# Altium project karmanDB_pcb.PrjPcb (part 3 of 3)

## Sheet karmanDB_amp.SchDoc
size A
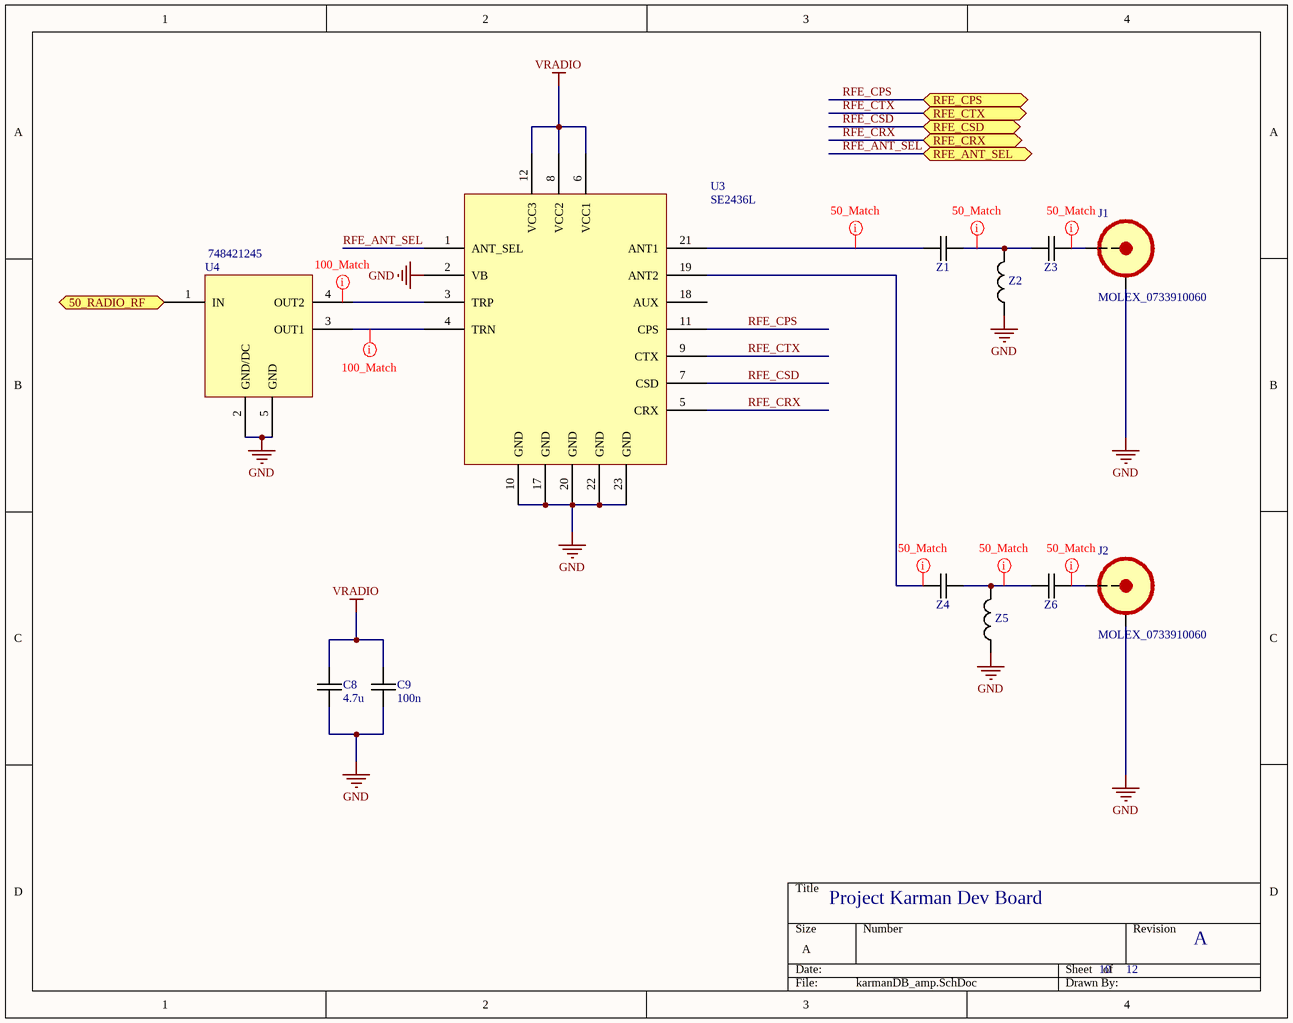
[diagram p9: karmanDB_amp.SchDoc]

### Parts
C8  4.7u  [MURATA_GRM_0603]
C9  100n  [MURATA_GRM_0603]
J1  MOLEX_0733910060  [MOLEX_0733910060]
J2  MOLEX_0733910060  [MOLEX_0733910060]
U3  SE2436L  [9 SE2436L]
U4  748421245  [748421245]
Z1  CAP_GENERIC_0402  [MURATA_GRM_0402]  (value not drawn)
Z2  IND_GENERIC_0402  [PANASONIC_ELJRF]  (value not drawn)
Z3  CAP_GENERIC_0402  [MURATA_GRM_0402]  (value not drawn)
Z4  CAP_GENERIC_0402  [MURATA_GRM_0402]  (value not drawn)
Z5  IND_GENERIC_0402  [PANASONIC_ELJRF]  (value not drawn)
Z6  CAP_GENERIC_0402  [MURATA_GRM_0402]  (value not drawn)

### Ports
50_RADIO_RF (in), RFE_ANT_SEL (bidir), RFE_CPS (bidir), RFE_CRX (bidir), RFE_CSD (bidir), RFE_CTX (bidir)

### Nets
GND: C8.2 C9.2 J1.SHIELD J2.SHIELD U3.2(VB) U3.10(GND) U3.17(GND) U3.20(GND) U3.22(GND) U3.23(GND) U4.2(GND/DC) U4.5(GND) Z2.1 Z5.1
VRADIO: C8.1 C9.1 U3.6(VCC1) U3.8(VCC2) U3.12(VCC3)
RFE_ANT_SEL: U3.1(ANT_SEL) ; port RFE_ANT_SEL
RFE_CPS: U3.11(CPS) ; port RFE_CPS
RFE_CRX: U3.5(CRX) ; port RFE_CRX
RFE_CSD: U3.7(CSD) ; port RFE_CSD
RFE_CTX: U3.9(CTX) ; port RFE_CTX
NetC47_2: U4.1(IN) ; port 50_RADIO_RF
NetJ1_PIN: J1.PIN Z3.2
NetJ2_PIN: J2.PIN Z6.2
NetU3_3: U3.3(TRP) U4.4(OUT2)
NetU3_4: U3.4(TRN) U4.3(OUT1)
NetU3_19: U3.19(ANT2) Z4.1
NetU3_21: U3.21(ANT1) Z1.1
NetZ1_2: Z1.2 Z2.2 Z3.1
NetZ4_2: Z4.2 Z5.2 Z6.1

Not connected (* = marked no-connect by the designer): U3 18(AUX)

### Layout directives
net class 50_Match_Class: NetJ1_PIN, NetJ2_PIN, NetU3_19, NetU3_21, NetZ1_2, NetZ4_2
net class 100_Match_Class: (no net found under the mark), NetU3_4

### Notes on the sheet
- Project Karman Dev Board
- 10
- 12
- A

### Library data of the parts
C8 = CAP_MURATA_GRM188R61C475MAAJD: CAP CER 4.7UF 16V 20% X5R 0603; Manufacturer: Murata Electronics North America; Capacitance: 4.7µF; Supplier 1: Digi-Key; Supplier Part Number 1: 490-10482-1-ND; Manufacturer Part Number: GRM188R61C475MAAJD; RoHS: RoHS Compliant; Category: Capacitors; Stock 1: 3465; Pricing: 1=0.3, 10=0.251, 25=0.1728, 50=0.1414, 100=0.1256, 250=0.0942, 500=0.08322, 1000=0.07379 (USD); Packaging: Cut Tape (CT); Tolerance: ±20%; Voltage - Rated: 16V; Temperature Coefficient: X5R; Mounting Type: Surface Mount, MLCC; Operating Temperature: -55°C ~ 85°C; Applications: General Purpose; Ratings: -; Package / Case: 0603 (1608 Metric); Size / Dimension: 0.063" L x 0.031" W (1.60mm x 0.80mm); Height - Seated (Max): -; Thickness (Max): 0.037" (0.95mm); Lead Spacing: -; Features: -; Lead Style: -; ComponentLink1URL: http://www.murata.com/~/media/webrenewal/support/library/catalog/products/capacitor/mlcc/c02e.ashx; ComponentLink1Description: http://www.murata.com/~/media/webrenewal/support/library/catalog/products/capacitor/mlcc/c02e.ashx
C9 = CAP_MURATA_GRM188R71C104KA01D: CAP CER 0.1UF 16V 10% X7R 0603; Manufacturer: Murata Electronics North America; Capacitance: 0.1µF; Supplier 1: Digi-Key; Supplier Part Number 1: 490-1532-1-ND; Manufacturer Part Number: GRM188R71C104KA01D; RoHS: RoHS Compliant; Category: Capacitors; Stock 1: 2486193; Pricing: 1=0.1, 10=0.019, 50=0.0102, 100=0.0086, 250=0.00704, 500=0.006, 1000=0.00468 (USD); Packaging: Cut Tape (CT); Tolerance: ±10%; Voltage - Rated: 16V; Temperature Coefficient: X7R; Mounting Type: Surface Mount, MLCC; Operating Temperature: -55°C ~ 125°C; Applications: General Purpose; Ratings: -; Package / Case: 0603 (1608 Metric); Size / Dimension: 0.063" L x 0.031" W (1.60mm x 0.80mm); Height - Seated (Max): -; Thickness (Max): 0.035" (0.90mm); Lead Spacing: -; Features: -; Lead Style: -; ComponentLink1URL: http://www.murata.com/~/media/webrenewal/support/library/catalog/products/capacitor/mlcc/c02e.ashx; ComponentLink1Description: http://www.murata.com/~/media/webrenewal/support/library/catalog/products/capacitor/mlcc/c02e.ashx
J1 J2 = MOLEX_0733910060: CONN SMA JACK STR 50 OHM PCB; Manufacturer: Molex Inc; Connector Type: Jack, Female Socket; Contact Termination: Solder; Impedance: 50 Ohm; Frequency - Max: 18GHz; Body Material: Brass; Body Finish: Gold; Center Contact Material: Beryllium Copper; Dielectric Material: Polytetrafluoroethylene (PTFE); Voltage Rating: 500V; Supplier 1: Digi-Key; Manufacturer Part Number: 0733910060; RoHS: RoHS Compliant; Category: Connectors, Interconnects; Stock 1: 6663; Packaging: Bulk; Connector Style: SMA; Shield Termination: Solder; Mounting Type: Through Hole; Cable Group: -; Fastening Type: Threaded; Features: -; Housing Color: Gold; Ingress Protection: -; Center Contact Plating: Gold; Operating Temperature: -65°C ~ 165°C; ComponentLink1URL: http://www.molex.com/pdm_docs/sd/733910060_sd.pdf; ComponentLink1Description: http://www.molex.com/pdm_docs/sd/733910060_sd.pdf; Supplier Part Number 1: WM5543-ND; Pricing: 1=2.99, 10=2.87, 25=2.6308, 50=2.5114, 100=2.3918, 250=2.09284, 500=2.03304, 1000=1.73406, 2500=1.61446 (USD)
U3 = SE2436L: ZIGBEE FRONT END MODULE; Manufacturer: Skyworks Solutions Inc.; Supplier 1: Digi-Key; Manufacturer Part Number: SE2436L; RoHS: RoHS Compliant; Category: RF/IF and RFID; Stock 1: 0; Pricing 1: 3000=1.5 (USD); ComponentLink1URL: http://www.skyworksinc.com/uploads/documents/SE2436L_202413C.pdf; ComponentLink1Description: http://www.skyworksinc.com/uploads/documents/SE2436L_202413C.pdf; Supplier Part Number 1: SE2436L-ND
U4 = 748421245: BALUN EMBER351 & 357 0805 SMD; Manufacturer: Wurth Electronics Inc; Frequency Range: 2.4GHz ~ 2.5GHz; Impedance - Unbalanced/Balanced: 50 / 100 Ohm; Phase Difference: 180° ±10; Insertion Loss (Max): 1.0dB; Supplier 1: Digi-Key; Manufacturer Part Number: 748421245; RoHS: RoHS Compliant; Category: RF/IF and RFID; Stock 1: 20266; Pricing 1: 1=2.63, 50=2.3626, 100=2.1875, 500=2.0125, 1000=1.925, 2000=1.8375 (USD); Packaging: Cut Tape (CT); Return Loss (Min): -; Package / Case: 0805 (2012 Metric); Mounting Type: Surface Mount; ComponentLink1URL: http://katalog.we-online.de/pbs/datasheet/748421245.pdf; ComponentLink1Description: http://katalog.we-online.de/pbs/datasheet/748421245.pdf; Supplier Part Number 1: 732-2230-1-ND
Z1 Z3 Z4 Z6 = CAP_GENERIC_0402: Generic Capacitor 0402 Package; Capacitance: 1000pF; Category: Capacitors; Applications: General Purpose; Size / Dimension: 0.039" L x 0.020" W (1.00mm x 0.50mm); Package / Case: 0402 (1005 Metric); Mounting Type: Surface Mount, MLCC
Z2 Z5 = IND_GENERIC_0402: Generic Inductor 0402 Package; Mounting Type: Surface Mount; Package / Case: 0402 (1005 Metric)

## Sheet karmanDB_pyro.SchDoc
size A
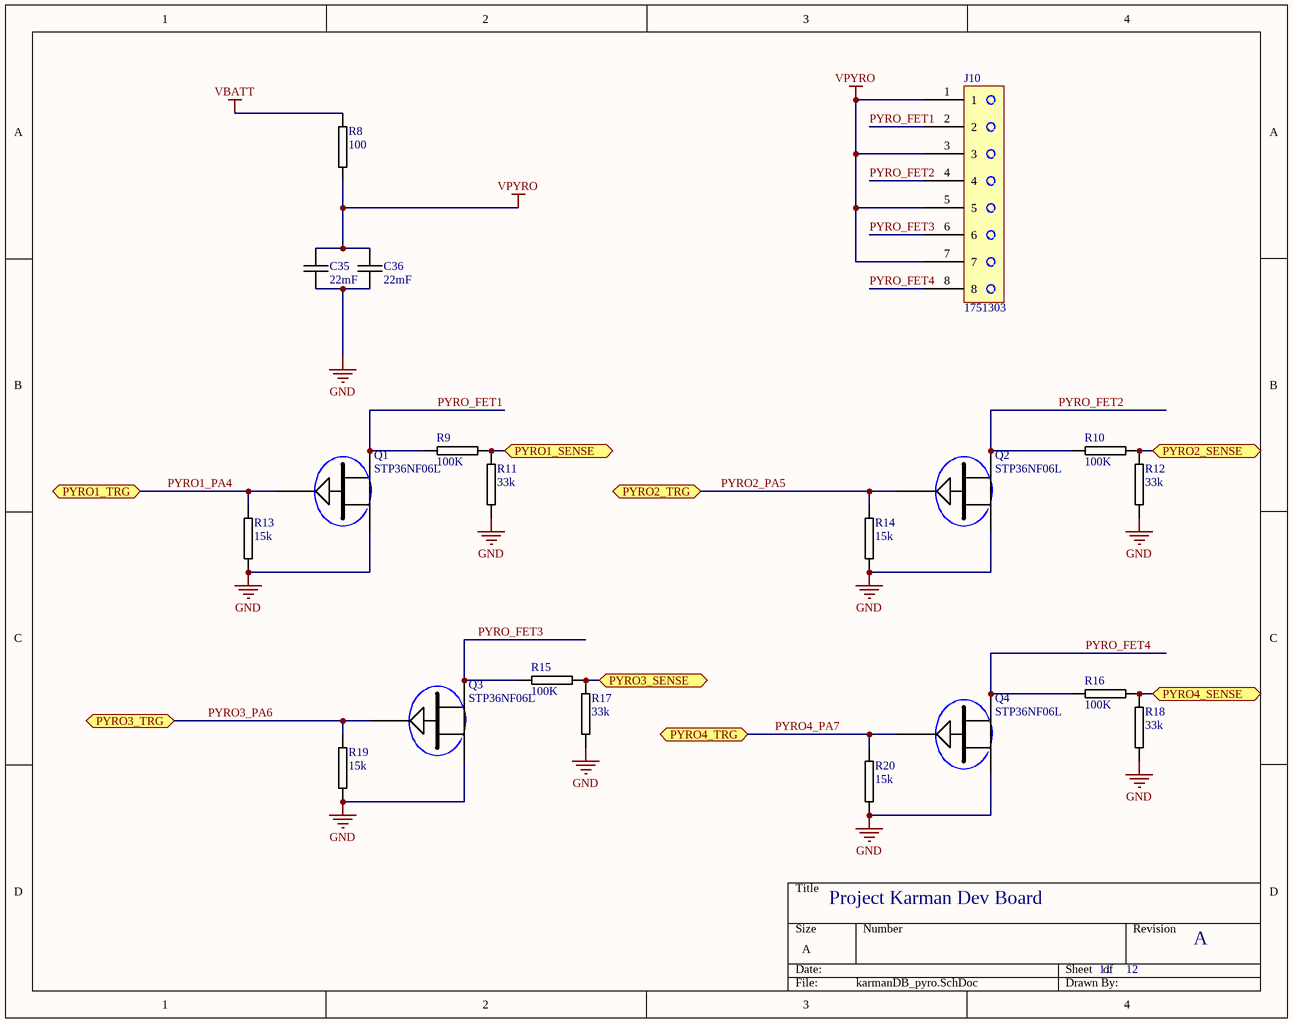
[diagram p10: karmanDB_pyro.SchDoc]

### Parts
C35  22mF  [AVX_BZ01]
C36  22mF  [AVX_BZ01]
J10  1751303  [1751303]
Q1  STP36NF06L  [ST(P/B)36NF06L]
Q2  STP36NF06L  [ST(P/B)36NF06L]
Q3  STP36NF06L  [ST(P/B)36NF06L]
Q4  STP36NF06L  [ST(P/B)36NF06L]
R8  100  [PANASONIC_ERJ1T]
R9  100K  [PANASONIC_ERJ3R]
R10  100K  [PANASONIC_ERJ3R]
R11  33k  [PANASONIC_ERJ2R_SERIES]
R12  33k  [PANASONIC_ERJ2R_SERIES]
R13  15k  [PANASONIC_ERJ3R]
R14  15k  [PANASONIC_ERJ3R]
R15  100K  [PANASONIC_ERJ3R]
R16  100K  [PANASONIC_ERJ3R]
R17  33k  [PANASONIC_ERJ2R_SERIES]
R18  33k  [PANASONIC_ERJ2R_SERIES]
R19  15k  [PANASONIC_ERJ3R]
R20  15k  [PANASONIC_ERJ3R]

### Ports
PYRO1_SENSE (bidir), PYRO1_TRG (bidir), PYRO2_SENSE (bidir), PYRO2_TRG (bidir), PYRO3_SENSE (bidir), PYRO3_TRG (bidir), PYRO4_SENSE (bidir), PYRO4_TRG (bidir)

### Nets
GND: C35.2 C36.2 Q1.3(S) Q2.3(S) Q3.3(S) Q4.3(S) R11.2 R12.2 R13.2 R14.2 R17.2 R18.2 R19.2 R20.2
VBATT: R8.1
VPYRO: C35.1 C36.1 J10.1 J10.3 J10.5 J10.7 R8.2
PYRO1_PA4: Q1.1(G) R13.1 ; port PYRO1_TRG
PYRO1_SENSE: R9.2 R11.1 ; port PYRO1_SENSE
PYRO2_PA5: Q2.1(G) R14.1 ; port PYRO2_TRG
PYRO2_SENSE: R10.2 R12.1 ; port PYRO2_SENSE
PYRO3_PA6: Q3.1(G) R19.1 ; port PYRO3_TRG
PYRO3_SENSE: R15.2 R17.1 ; port PYRO3_SENSE
PYRO4_PA7: Q4.1(G) R20.1 ; port PYRO4_TRG
PYRO4_SENSE: R16.2 R18.1 ; port PYRO4_SENSE
PYRO_FET1: J10.2 Q1.2(D) R9.1
PYRO_FET2: J10.4 Q2.2(D) R10.1
PYRO_FET3: J10.6 Q3.2(D) R15.1
PYRO_FET4: J10.8 Q4.2(D) R16.1

### Notes on the sheet
- Project Karman Dev Board
- 11
- 12
- A

### Library data of the parts
C35 C36 = BZ01CA223ZSB: CAP 22MF -20% +80% 12V SMD; Manufacturer: AVX Corporation; Tolerance: -20%, +80%; ESR (Equivalent Series Resistance): 350 mOhm; Lifetime @ Temp.: 1000 Hrs @ 70°C; Supplier 1: Digi-Key; Manufacturer Part Number: BZ01CA223ZSB; RoHS: RoHS Compliant; Category: Capacitors; Stock 1: 220; Pricing 1: 1=15, 10=14.25, 100=11.25, 250=10.5, 500=9.975, 1000=9.375, 5000=9 (USD); Packaging: Tray; Capacitance: 22mF; Voltage - Rated: 12V; Termination: Solder Pads; Mounting Type: Surface Mount; Package / Case: BZ01, 3 Lead; Lead Spacing: -; Size / Dimension: 1.102" L x 0.669" W (28.00mm x 17.00mm); Height - Seated (Max): 0.299" (7.60mm); Operating Temperature: -20°C ~ 70°C; ComponentLink1URL: http://www.avx.com/docs/catalogs/bestcap.pdf; ComponentLink1Description: http://www.avx.com/docs/catalogs/bestcap.pdf; Supplier Part Number 1: 478-3523-ND
J10 = 1751303: CONN TERM BLOCK 8POS 3.5MM; Manufacturer: Phoenix Contact; Number of Levels: 1; Positions Per Level: 8; Pitch: 0.138" (3.50mm); Mating Orientation: Horizontal with Board; Current: 10A; Voltage: 300V; Wire Gauge: 16-30 AWG; Wire Termination: Screw - Rising Cage Clamp; Torque - Screw: 0.22-0.25 Nm (1.9-2.2 Lb-In); Screw Thread: M2; Supplier 1: Digi-Key; Manufacturer Part Number: 1751303; RoHS: RoHS Compliant; Category: Connectors, Interconnects; Stock 1: 1222; Pricing 1: 1=4.43, 10=4.241, 50=4.1254, 100=3.8556, 250=3.54716, 500=3.27726, 1000=3.06181, 2500=2.8728 (USD); Packaging: Bulk; Mounting Type: Through Hole; Features: -; Color: Green; Operating Temperature: -; Housing Material: Polyamide (PA), Nylon; Contact Material - Plating: -; Clamp Material - Plating: -; Screw Material - Plating: -; ComponentLink1URL: http://media.digikey.com/PDF/Data%20Sheets/Phoenix%20Contact%20PDFs/1751303.pdf; ComponentLink1Description: http://media.digikey.com/PDF/Data%20Sheets/Phoenix%20Contact%20PDFs/1751303.pdf; Supplier Part Number 1: 277-5792-ND
Q1-Q4 = STP36NF06L: MOSFET N-CH 60V 30A TO-220; Manufacturer: STMicroelectronics; FET Type: MOSFET N-Channel, Metal Oxide; FET Feature: Standard; Current - Continuous Drain (Id) @ 25°C: 30A (Tc); Rds On (Max) @ Id, Vgs: 40 mOhm @ 15A, 10V; Vgs(th) (Max) @ Id: 2.5V @ 250µA; Gate Charge (Qg) @ Vgs: 17nC @ 5V; Input Capacitance (Ciss) @ Vds: 660pF @ 25V; Power - Max: 70W; Supplier 1: Digi-Key; Manufacturer Part Number: STP36NF06L; RoHS: RoHS Compliant; Category: Discrete Semiconductor Products; Stock 1: 547; Pricing 1: 1=1.1, 10=0.851, 100=0.677, 500=0.618, 1000=0.472, 2500=0.419, 10000=0.403, 25000=0.39375 (USD); Packaging: Tube; Drain to Source Voltage (Vdss): 60V; Mounting Type: Through Hole; Package / Case: TO-220-3; Supplier Device Package: TO-220AB; ComponentLink1URL: http://www.st.com/web/en/resource/technical/document/datasheet/CD00003405.pdf; ComponentLink1Description: http://www.st.com/web/en/resource/technical/document/datasheet/CD00003405.pdf; Supplier Part Number 1: 497-7522-5-ND
R8 = RES_PANASONIC_ERJ-1TYJ101U: RES SMD 100 OHM 5% 1W 2512; Supplier 1: Digi-Key; Supplier Part Number 1: PT100XTR-ND
R9 R10 R15 R16 = RES_PANASONIC_ERJ-3GEYJ104V: RES SMD 100K OHM 5% 1/10W 0603; Manufacturer: Panasonic Electronic Components; Power (Watts): 0.1W, 1/10W; Temperature Coefficient: ±200ppm/°C; Supplier 1: Digi-Key; Supplier Part Number 1: P100KGCT-ND; Manufacturer Part Number: ERJ-3GEYJ104V; RoHS: RoHS Compliant; Category: Resistors; Stock 1: 1746081; Pricing: 1=0.1, 50=0.0096, 100=0.0071, 250=0.00544, 500=0.00436, 1000=0.00321 (USD); Packaging: Cut Tape (CT); Resistance (Ohms): 100k; Tolerance: ±5%; Composition: Thick Film; Features: Automotive AEC-Q200; Operating Temperature: -55°C ~ 155°C; Package / Case: 0603 (1608 Metric); Supplier Device Package: 0603; Size / Dimension: 0.063" L x 0.031" W (1.60mm x 0.80mm); Height: 0.022" (0.55mm); Number of Terminations: 2; ComponentLink1URL: http://industrial.panasonic.com/www-cgi/jvcr13pz.cgi?E+PZ+3+AOA0001+ERJ3GEYJ104V+7+WW; ComponentLink1Description: http://industrial.panasonic.com/www-cgi/jvcr13pz.cgi?E+PZ+3+AOA0001+ERJ3GEYJ104V+7+WW
R11 R12 R17 R18 = RES_PANASONIC_ERJ-2GEJ333X: RES SMD 33K OHM 5% 1/10W 0402; Manufacturer: Panasonic Electronic Components; Power (Watts): 0.1W, 1/10W; Temperature Coefficient: ±200ppm/°C; Supplier 1: Digi-Key; Manufacturer Part Number: ERJ-2GEJ333X; RoHS: RoHS Compliant; Category: Resistors; Stock 1: 860000; Pricing 1: 10000=0.00198, 30000=0.00174, 50000=0.0016, 100000=0.00156 (USD); Packaging: Tape & Reel (TR); Resistance (Ohms): 33k; Tolerance: ±5%; Composition: Thick Film; Features: Automotive AEC-Q200; Operating Temperature: -55°C ~ 155°C; Package / Case: 0402 (1005 Metric); Supplier Device Package: 0402; Size / Dimension: 0.039" L x 0.020" W (1.00mm x 0.50mm); Height: 0.016" (0.40mm); Number of Terminations: 2; ComponentLink1URL: http://industrial.panasonic.com/www-cgi/jvcr13pz.cgi?E+PZ+3+AOA0001+ERJ2GEJ333X+7+WW; ComponentLink1Description: http://industrial.panasonic.com/www-cgi/jvcr13pz.cgi?E+PZ+3+AOA0001+ERJ2GEJ333X+7+WW; Supplier Part Number 1: P33KJTR-ND
R13 R14 R19 R20 = RES_PAN_ERA-3AED153V: RES SMD 15K OHM 0.5% 1/10W 0603; Manufacturer: Panasonic Electronic Components; Power (Watts): 0.1W, 1/10W; Temperature Coefficient: ±25ppm/°C; Supplier 1: Digi-Key; Manufacturer Part Number: ERA-3AED153V; RoHS: RoHS Compliant; Category: Resistors; Stock 1: 5000; Pricing 1: 5000=0.01558, 10000=0.01353, 25000=0.01189, 50000=0.01091, 125000=0.01068 (USD); Packaging: Tape & Reel (TR); Resistance (Ohms): 15k; Tolerance: ±0.5%; Composition: Thin Film; Features: Automotive AEC-Q200; Operating Temperature: -55°C ~ 155°C; Package / Case: 0603 (1608 Metric); Supplier Device Package: 0603; Size / Dimension: 0.063" L x 0.031" W (1.60mm x 0.80mm); Height: 0.022" (0.55mm); Number of Terminations: 2; ComponentLink1URL: http://industrial.panasonic.com/lecs/www-data/pdf/AOA0000/AOA0000CE26.pdf; ComponentLink1Description: http://industrial.panasonic.com/lecs/www-data/pdf/AOA0000/AOA0000CE26.pdf; Supplier Part Number 1: P15KBLTR-ND

## Sheet karmanDB_testpoints.SchDoc
size A
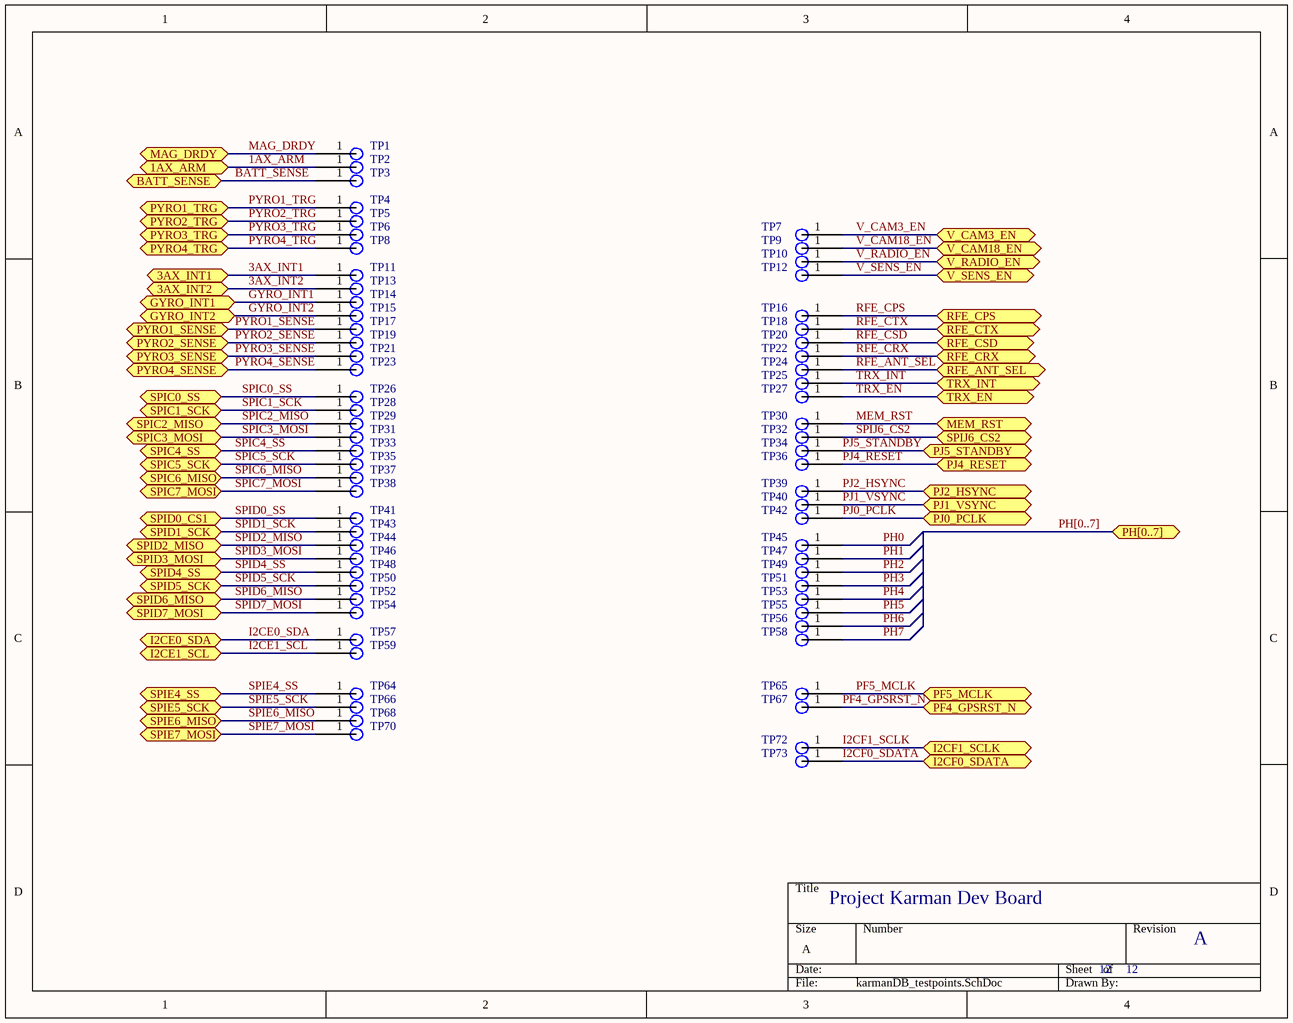
[diagram p11: karmanDB_testpoints.SchDoc]

### Parts
TP1  test_point  [TESTPOINT]  (value not drawn)
TP2  test_point  [TESTPOINT]  (value not drawn)
TP3  test_point  [TESTPOINT]  (value not drawn)
TP4  test_point  [TESTPOINT]  (value not drawn)
TP5  test_point  [TESTPOINT]  (value not drawn)
TP6  test_point  [TESTPOINT]  (value not drawn)
TP7  test_point  [TESTPOINT]  (value not drawn)
TP8  test_point  [TESTPOINT]  (value not drawn)
TP9  test_point  [TESTPOINT]  (value not drawn)
TP10  test_point  [TESTPOINT]  (value not drawn)
TP11  test_point  [TESTPOINT]  (value not drawn)
TP12  test_point  [TESTPOINT]  (value not drawn)
TP13  test_point  [TESTPOINT]  (value not drawn)
TP14  test_point  [TESTPOINT]  (value not drawn)
TP15  test_point  [TESTPOINT]  (value not drawn)
TP16  test_point  [TESTPOINT]  (value not drawn)
TP17  test_point  [TESTPOINT]  (value not drawn)
TP18  test_point  [TESTPOINT]  (value not drawn)
TP19  test_point  [TESTPOINT]  (value not drawn)
TP20  test_point  [TESTPOINT]  (value not drawn)
TP21  test_point  [TESTPOINT]  (value not drawn)
TP22  test_point  [TESTPOINT]  (value not drawn)
TP23  test_point  [TESTPOINT]  (value not drawn)
TP24  test_point  [TESTPOINT]  (value not drawn)
TP25  test_point  [TESTPOINT]  (value not drawn)
TP26  test_point  [TESTPOINT]  (value not drawn)
TP27  test_point  [TESTPOINT]  (value not drawn)
TP28  test_point  [TESTPOINT]  (value not drawn)
TP29  test_point  [TESTPOINT]  (value not drawn)
TP30  test_point  [TESTPOINT]  (value not drawn)
TP31  test_point  [TESTPOINT]  (value not drawn)
TP32  test_point  [TESTPOINT]  (value not drawn)
TP33  test_point  [TESTPOINT]  (value not drawn)
TP34  test_point  [TESTPOINT]  (value not drawn)
TP35  test_point  [TESTPOINT]  (value not drawn)
TP36  test_point  [TESTPOINT]  (value not drawn)
TP37  test_point  [TESTPOINT]  (value not drawn)
TP38  test_point  [TESTPOINT]  (value not drawn)
TP39  test_point  [TESTPOINT]  (value not drawn)
TP40  test_point  [TESTPOINT]  (value not drawn)
TP41  test_point  [TESTPOINT]  (value not drawn)
TP42  test_point  [TESTPOINT]  (value not drawn)
TP43  test_point  [TESTPOINT]  (value not drawn)
TP44  test_point  [TESTPOINT]  (value not drawn)
TP45  test_point  [TESTPOINT]  (value not drawn)
TP46  test_point  [TESTPOINT]  (value not drawn)
TP47  test_point  [TESTPOINT]  (value not drawn)
TP48  test_point  [TESTPOINT]  (value not drawn)
TP49  test_point  [TESTPOINT]  (value not drawn)
TP50  test_point  [TESTPOINT]  (value not drawn)
TP51  test_point  [TESTPOINT]  (value not drawn)
TP52  test_point  [TESTPOINT]  (value not drawn)
TP53  test_point  [TESTPOINT]  (value not drawn)
TP54  test_point  [TESTPOINT]  (value not drawn)
TP55  test_point  [TESTPOINT]  (value not drawn)
TP56  test_point  [TESTPOINT]  (value not drawn)
TP57  test_point  [TESTPOINT]  (value not drawn)
TP58  test_point  [TESTPOINT]  (value not drawn)
TP59  test_point  [TESTPOINT]  (value not drawn)
TP64  test_point  [TESTPOINT]  (value not drawn)
TP65  test_point  [TESTPOINT]  (value not drawn)
TP66  test_point  [TESTPOINT]  (value not drawn)
TP67  test_point  [TESTPOINT]  (value not drawn)
TP68  test_point  [TESTPOINT]  (value not drawn)
TP70  test_point  [TESTPOINT]  (value not drawn)
TP72  test_point  [TESTPOINT]  (value not drawn)
TP73  test_point  [TESTPOINT]  (value not drawn)

### Ports
1AX_ARM (bidir), 3AX_INT1 (bidir), 3AX_INT2 (bidir), BATT_SENSE (bidir), GYRO_INT1 (bidir), GYRO_INT2 (bidir), I2CE0_SDA (bidir), I2CE1_SCL (bidir), I2CF0_SDATA (bidir), I2CF1_SCLK (bidir), MAG_DRDY (bidir), MEM_RST (bidir), PF4_GPSRST_N (bidir), PF5_MCLK (bidir), PH[0..7] (bidir), PJ0_PCLK (bidir), PJ1_VSYNC (bidir), PJ2_HSYNC (bidir), PJ4_RESET (bidir), PJ5_STANDBY (bidir), PYRO1_SENSE (bidir), PYRO1_TRG (bidir), PYRO2_SENSE (bidir), PYRO2_TRG (bidir), PYRO3_SENSE (bidir), PYRO3_TRG (bidir), PYRO4_SENSE (bidir), PYRO4_TRG (bidir), RFE_ANT_SEL (bidir), RFE_CPS (bidir), RFE_CRX (bidir), RFE_CSD (bidir), RFE_CTX (bidir), SPIC0_SS (bidir), SPIC1_SCK (bidir), SPIC2_MISO (bidir), SPIC3_MOSI (bidir), SPIC4_SS (bidir), SPIC5_SCK (bidir), SPIC6_MISO (bidir), SPIC7_MOSI (bidir), SPID0_CS1 (bidir), SPID1_SCK (bidir), SPID2_MISO (bidir), SPID3_MOSI (bidir), SPID4_SS (bidir), SPID5_SCK (bidir), SPID6_MISO (bidir), SPID7_MOSI (bidir), SPIE4_SS (bidir), SPIE5_SCK (bidir), SPIE6_MISO (bidir), SPIE7_MOSI (bidir), SPIJ6_CS2 (bidir), TRX_EN (bidir), TRX_INT (bidir), V_CAM3_EN (bidir), V_CAM18_EN (bidir), V_RADIO_EN (bidir), V_SENS_EN (bidir)

### Nets
1AX_ARM: TP2.1 ; port 1AX_ARM
3AX_INT1: TP11.1 ; port 3AX_INT1
3AX_INT2: TP13.1 ; port 3AX_INT2
BATT_SENSE: TP3.1 ; port BATT_SENSE
GYRO_INT1: TP14.1 ; port GYRO_INT1
GYRO_INT2: TP15.1 ; port GYRO_INT2
I2CE0_SDA: TP57.1 ; port I2CE0_SDA
I2CE1_SCL: TP59.1 ; port I2CE1_SCL
I2CF0_SDATA: TP73.1 ; port I2CF0_SDATA
I2CF1_SCLK: TP72.1 ; port I2CF1_SCLK
MAG_DRDY: TP1.1 ; port MAG_DRDY
MEM_RST: TP30.1 ; port MEM_RST
PF4_GPSRST_N: TP67.1 ; port PF4_GPSRST_N
PF5_MCLK: TP65.1 ; port PF5_MCLK
PH0: TP45.1
PH1: TP47.1
PH2: TP49.1
PH3: TP51.1
PH4: TP53.1
PH5: TP55.1
PH6: TP56.1
PH7: TP58.1
PJ0_PCLK: TP42.1 ; port PJ0_PCLK
PJ1_VSYNC: TP40.1 ; port PJ1_VSYNC
PJ2_HSYNC: TP39.1 ; port PJ2_HSYNC
PJ4_RESET: TP36.1 ; port PJ4_RESET
PJ5_STANDBY: TP34.1 ; port PJ5_STANDBY
PYRO1_SENSE: TP17.1 ; port PYRO1_SENSE
PYRO1_TRG: TP4.1 ; port PYRO1_TRG  [project net PYRO1_PA4]
PYRO2_SENSE: TP19.1 ; port PYRO2_SENSE
PYRO2_TRG: TP5.1 ; port PYRO2_TRG  [project net PYRO2_PA5]
PYRO3_SENSE: TP21.1 ; port PYRO3_SENSE
PYRO3_TRG: TP6.1 ; port PYRO3_TRG  [project net PYRO3_PA6]
PYRO4_SENSE: TP23.1 ; port PYRO4_SENSE
PYRO4_TRG: TP8.1 ; port PYRO4_TRG  [project net PYRO4_PA7]
RFE_ANT_SEL: TP24.1 ; port RFE_ANT_SEL
RFE_CPS: TP16.1 ; port RFE_CPS
RFE_CRX: TP22.1 ; port RFE_CRX
RFE_CSD: TP20.1 ; port RFE_CSD
RFE_CTX: TP18.1 ; port RFE_CTX
SPIC0_SS: TP26.1 ; port SPIC0_SS
SPIC1_SCK: TP28.1 ; port SPIC1_SCK
SPIC2_MISO: TP29.1 ; port SPIC2_MISO
SPIC3_MOSI: TP31.1 ; port SPIC3_MOSI
SPIC4_SS: TP33.1 ; port SPIC4_SS
SPIC5_SCK: TP35.1 ; port SPIC5_SCK
SPIC6_MISO: TP37.1 ; port SPIC6_MISO
SPIC7_MOSI: TP38.1 ; port SPIC7_MOSI
SPID0_SS: TP41.1 ; port SPID0_CS1  [project net SPID0_CS1]
SPID1_SCK: TP43.1 ; port SPID1_SCK
SPID2_MISO: TP44.1 ; port SPID2_MISO
SPID3_MOSI: TP46.1 ; port SPID3_MOSI
SPID4_SS: TP48.1 ; port SPID4_SS
SPID5_SCK: TP50.1 ; port SPID5_SCK
SPID6_MISO: TP52.1 ; port SPID6_MISO
SPID7_MOSI: TP54.1 ; port SPID7_MOSI
SPIE4_SS: TP64.1 ; port SPIE4_SS
SPIE5_SCK: TP66.1 ; port SPIE5_SCK
SPIE6_MISO: TP68.1 ; port SPIE6_MISO
SPIE7_MOSI: TP70.1 ; port SPIE7_MOSI
SPIJ6_CS2: TP32.1 ; port SPIJ6_CS2
TRX_EN: TP27.1 ; port TRX_EN
TRX_INT: TP25.1 ; port TRX_INT
V_CAM3_EN: TP7.1 ; port V_CAM3_EN
V_CAM18_EN: TP9.1 ; port V_CAM18_EN
V_RADIO_EN: TP10.1 ; port V_RADIO_EN
V_SENS_EN: TP12.1 ; port V_SENS_EN

### Buses and harness runs
bus PH[0..7] = port PH[0..7]

### Notes on the sheet
- Project Karman Dev Board
- 12
- A

## Nets that join several sheets
GND: karmanDB_sensors2 (16 pins), karmanDB_accel (18 pins), karmanDB_sensors1 (C37.2 C38.2 U14.3 U15.2), karmanDB_MCU (22 pins), karmanDB_power (33 pins), karmanDB_transceiver (14 pins), karmanDB_mem (U8.10), karmanDB_gps&gs (7 pins), karmanDB_camera (C10.2 J3.12 J3.17), karmanDB_amp (14 pins), karmanDB_pyro (14 pins)
V_SENS: karmanDB_sensors2 (9 pins), karmanDB_accel (5 pins), karmanDB_sensors1 (8 pins), karmanDB_power (11 pins), karmanDB_gps&gs (U5.6 U5.7 U5.8)
V_SYS: karmanDB_MCU (17 pins), karmanDB_power (7 pins), karmanDB_mem (U8.2)
VBATT: karmanDB_power (8 pins), karmanDB_pyro (R8.1)
VCAM1_8: karmanDB_power (C23.1 J16.1 R25.2 U9.5), karmanDB_camera (J3.10)
VCAM3: karmanDB_power (C28.1 J15.1 R26.2 U11.5), karmanDB_camera (J3.11 L2.2)
VRADIO: karmanDB_power (C32.1 J14.1 R7.1 U12.4), karmanDB_transceiver (5 pins), karmanDB_amp (5 pins)
1AX_ARM: karmanDB_accel (U2.6), karmanDB_MCU (U7.96), karmanDB_testpoints (TP2.1)
3AX_INT1: karmanDB_accel (U1.11), karmanDB_MCU (U7.5), karmanDB_testpoints (TP11.1)
3AX_INT2: karmanDB_accel (U1.9), karmanDB_MCU (U7.6), karmanDB_testpoints (TP13.1)
BATT_SENSE: karmanDB_MCU (U7.97), karmanDB_power (R1.2 R3.1), karmanDB_testpoints (TP3.1)
GYRO_INT1: karmanDB_sensors2 (U16.7), karmanDB_MCU (U7.7), karmanDB_testpoints (TP14.1)
GYRO_INT2: karmanDB_sensors2 (U16.6), karmanDB_MCU (U7.8), karmanDB_testpoints (TP15.1)
I2CE0_SDA: karmanDB_sensors2 (U17.16), karmanDB_sensors1 (R22.2 U14.7 U15.1), karmanDB_MCU (U7.35), karmanDB_testpoints (TP57.1)
I2CE1_SCL: karmanDB_sensors2 (U17.1), karmanDB_sensors1 (R21.2 U14.8 U15.6), karmanDB_MCU (U7.36), karmanDB_testpoints (TP59.1)
I2CF0_SDATA: karmanDB_MCU (U7.45), karmanDB_camera (J3.18), karmanDB_testpoints (TP73.1)
I2CF1_SCLK: karmanDB_MCU (U7.46), karmanDB_camera (J3.19), karmanDB_testpoints (TP72.1)
MAG_DRDY: karmanDB_sensors2 (U17.15), karmanDB_MCU (U7.95), karmanDB_testpoints (TP1.1)
MEM_RST: karmanDB_MCU (U7.72), karmanDB_mem (U8.3), karmanDB_testpoints (TP30.1)
NetC47_2: karmanDB_transceiver (C47.2 C48.1), karmanDB_amp (U4.1)
PF4_GPSRST_N: karmanDB_MCU (U7.49), karmanDB_gps&gs (U5.9), karmanDB_testpoints (TP67.1)
PF5_MCLK: karmanDB_MCU (U7.50), karmanDB_camera (J3.16), karmanDB_testpoints (TP65.1)
PH0: karmanDB_MCU (U7.62), karmanDB_camera (J3.1), karmanDB_testpoints (TP45.1)
PH1: karmanDB_MCU (U7.61), karmanDB_camera (J3.2), karmanDB_testpoints (TP47.1)
PH2: karmanDB_MCU (U7.60), karmanDB_camera (J3.3), karmanDB_testpoints (TP49.1)
PH3: karmanDB_MCU (U7.59), karmanDB_camera (J3.4), karmanDB_testpoints (TP51.1)
PH4: karmanDB_MCU (U7.58), karmanDB_camera (J3.5), karmanDB_testpoints (TP53.1)
PH5: karmanDB_MCU (U7.57), karmanDB_camera (J3.6), karmanDB_testpoints (TP55.1)
PH6: karmanDB_MCU (U7.56), karmanDB_camera (J3.7), karmanDB_testpoints (TP56.1)
PH7: karmanDB_MCU (U7.55), karmanDB_camera (J3.8), karmanDB_testpoints (TP58.1)
PJ0_PCLK: karmanDB_MCU (U7.65), karmanDB_camera (J3.9), karmanDB_testpoints (TP42.1)
PJ1_VSYNC: karmanDB_MCU (U7.66), karmanDB_camera (J3.14), karmanDB_testpoints (TP40.1)
PJ2_HSYNC: karmanDB_MCU (U7.67), karmanDB_camera (J3.15), karmanDB_testpoints (TP39.1)
PJ4_RESET: karmanDB_MCU (U7.69), karmanDB_camera (J3.20), karmanDB_testpoints (TP36.1)
PJ5_STANDBY: karmanDB_MCU (U7.70), karmanDB_camera (J3.21), karmanDB_testpoints (TP34.1)
PYRO1_PA4: karmanDB_MCU (U7.99), karmanDB_pyro (Q1.1 R13.1), karmanDB_testpoints (TP4.1)
PYRO1_SENSE: karmanDB_MCU (U7.9), karmanDB_pyro (R9.2 R11.1), karmanDB_testpoints (TP17.1)
PYRO2_PA5: karmanDB_MCU (U7.100), karmanDB_pyro (Q2.1 R14.1), karmanDB_testpoints (TP5.1)
PYRO2_SENSE: karmanDB_MCU (U7.10), karmanDB_pyro (R10.2 R12.1), karmanDB_testpoints (TP19.1)
PYRO3_PA6: karmanDB_MCU (U7.1), karmanDB_pyro (Q3.1 R19.1), karmanDB_testpoints (TP6.1)
PYRO3_SENSE: karmanDB_MCU (U7.11), karmanDB_pyro (R15.2 R17.1), karmanDB_testpoints (TP21.1)
PYRO4_PA7: karmanDB_MCU (U7.2), karmanDB_pyro (Q4.1 R20.1), karmanDB_testpoints (TP8.1)
PYRO4_SENSE: karmanDB_MCU (U7.12), karmanDB_pyro (R16.2 R18.1), karmanDB_testpoints (TP23.1)
RFE_ANT_SEL: karmanDB_MCU (U7.77), karmanDB_amp (U3.1), karmanDB_testpoints (TP24.1)
RFE_CPS: karmanDB_MCU (U7.81), karmanDB_amp (U3.11), karmanDB_testpoints (TP16.1)
RFE_CRX: karmanDB_MCU (U7.78), karmanDB_amp (U3.5), karmanDB_testpoints (TP22.1)
RFE_CSD: karmanDB_MCU (U7.79), karmanDB_amp (U3.7), karmanDB_testpoints (TP20.1)
RFE_CTX: karmanDB_MCU (U7.80), karmanDB_amp (U3.9), karmanDB_testpoints (TP18.1)
SPIC0_SS: karmanDB_MCU (U7.15), karmanDB_transceiver (U18.2), karmanDB_testpoints (TP26.1)
SPIC1_SCK: karmanDB_MCU (U7.16), karmanDB_transceiver (U18.3), karmanDB_testpoints (TP28.1)
SPIC2_MISO: karmanDB_MCU (U7.17), karmanDB_transceiver (U18.5), karmanDB_testpoints (TP29.1)
SPIC3_MOSI: karmanDB_MCU (U7.18), karmanDB_transceiver (U18.4), karmanDB_testpoints (TP31.1)
SPIC4_SS: karmanDB_sensors2 (U16.5), karmanDB_MCU (U7.19), karmanDB_testpoints (TP33.1)
SPIC5_SCK: karmanDB_sensors2 (U16.2), karmanDB_MCU (U7.20), karmanDB_testpoints (TP35.1)
SPIC6_MISO: karmanDB_sensors2 (U16.4), karmanDB_MCU (U7.21), karmanDB_testpoints (TP37.1)
SPIC7_MOSI: karmanDB_sensors2 (U16.3), karmanDB_MCU (U7.22), karmanDB_testpoints (TP38.1)
SPID0_CS1: karmanDB_MCU (U7.25), karmanDB_mem (U8.7), karmanDB_testpoints (TP41.1)
SPID1_SCK: karmanDB_MCU (U7.26), karmanDB_mem (U8.16), karmanDB_testpoints (TP43.1)
SPID2_MISO: karmanDB_MCU (U7.27), karmanDB_mem (U8.8), karmanDB_testpoints (TP44.1)
SPID3_MOSI: karmanDB_MCU (U7.28), karmanDB_mem (U8.15), karmanDB_testpoints (TP46.1)
SPID4_SS: karmanDB_accel (U2.12), karmanDB_MCU (U7.29), karmanDB_testpoints (TP48.1)
SPID5_SCK: karmanDB_accel (U2.10), karmanDB_MCU (U7.30), karmanDB_testpoints (TP50.1)
SPID6_MISO: karmanDB_accel (U2.8), karmanDB_MCU (U7.31), karmanDB_testpoints (TP52.1)
SPID7_MOSI: karmanDB_accel (U2.11), karmanDB_MCU (U7.32), karmanDB_testpoints (TP54.1)
SPIE4_SS: karmanDB_accel (U1.10), karmanDB_MCU (U7.39), karmanDB_testpoints (TP64.1)
SPIE5_SCK: karmanDB_accel (U1.4), karmanDB_MCU (U7.40), karmanDB_testpoints (TP66.1)
SPIE6_MISO: karmanDB_accel (U1.7), karmanDB_MCU (U7.41), karmanDB_testpoints (TP68.1)
SPIE7_MOSI: karmanDB_accel (U1.6), karmanDB_MCU (U7.42), karmanDB_testpoints (TP70.1)
SPIJ6_CS2: karmanDB_MCU (U7.71), karmanDB_mem (U8.6), karmanDB_testpoints (TP32.1)
TRX_EN: karmanDB_MCU (U7.75), karmanDB_transceiver (U18.1), karmanDB_testpoints (TP27.1)
TRX_INT: karmanDB_MCU (U7.76), karmanDB_transceiver (U18.6), karmanDB_testpoints (TP25.1)
UARTE2_RXD: karmanDB_MCU (U7.37), karmanDB_gps&gs (J6.2)
UARTE3_TXD: karmanDB_MCU (U7.38), karmanDB_gps&gs (J6.1)
UARTF2_RXD: karmanDB_MCU (U7.47), karmanDB_gps&gs (J5.3)
UARTF3_TXD: karmanDB_MCU (U7.48), karmanDB_gps&gs (J5.2)
V_CAM3_EN: karmanDB_MCU (U7.88), karmanDB_power (R6.2 U11.3), karmanDB_testpoints (TP7.1)
V_CAM18_EN: karmanDB_MCU (U7.87), karmanDB_power (R4.2 U9.3), karmanDB_testpoints (TP9.1)
V_RADIO_EN: karmanDB_MCU (U7.86), karmanDB_power (U12.1), karmanDB_testpoints (TP10.1)
V_SENS_EN: karmanDB_MCU (U7.85), karmanDB_power (U13.3), karmanDB_testpoints (TP12.1)